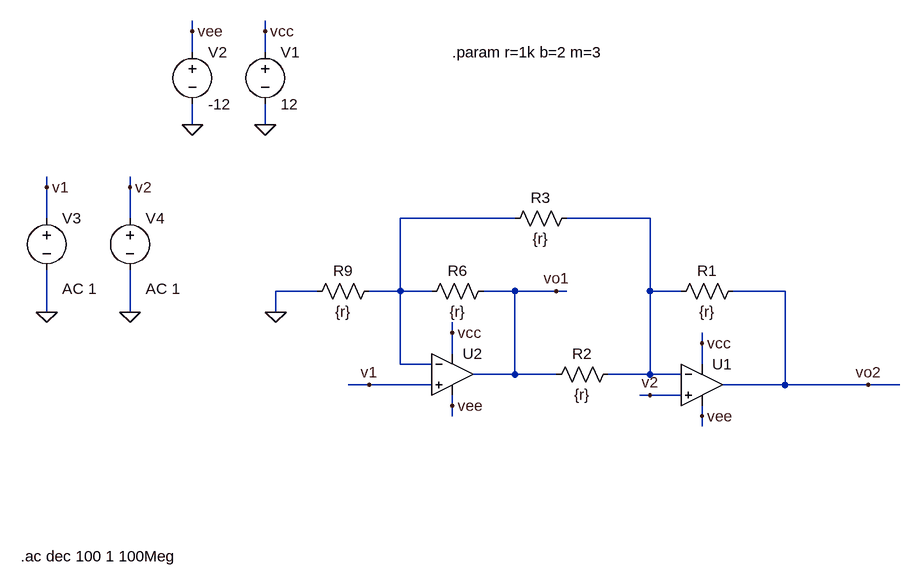
[diagram p0: schematic Draft1.asc]
Draft1.asc, the LTspice schematic file:
Version 4
SHEET 1 1172 680
WIRE -400 -176 -400 -192
WIRE -288 -176 -288 -192
WIRE -400 -144 -400 -176
WIRE -288 -144 -288 -176
WIRE -400 -32 -400 -64
WIRE -288 -32 -288 -64
WIRE -624 64 -624 48
WIRE -496 64 -496 48
WIRE -624 112 -624 64
WIRE -496 112 -496 64
WIRE 96 112 -80 112
WIRE 304 112 176 112
WIRE -208 224 -272 224
WIRE -80 224 -80 112
WIRE -80 224 -128 224
WIRE -32 224 -80 224
WIRE 96 224 48 224
WIRE 160 224 96 224
WIRE 176 224 160 224
WIRE 304 224 304 112
WIRE 352 224 304 224
WIRE 512 224 432 224
WIRE -624 256 -624 192
WIRE -496 256 -496 192
WIRE -272 256 -272 224
WIRE 0 288 0 272
WIRE 384 304 384 288
WIRE 0 320 0 288
WIRE -80 336 -80 224
WIRE -32 336 -80 336
WIRE 384 336 384 304
WIRE 96 352 96 224
WIRE 96 352 32 352
WIRE 160 352 96 352
WIRE 304 352 304 224
WIRE 304 352 240 352
WIRE 352 352 304 352
WIRE -128 368 -160 368
WIRE -32 368 -128 368
WIRE 512 368 512 224
WIRE 512 368 416 368
WIRE 640 368 512 368
WIRE 688 368 640 368
WIRE 304 384 288 384
WIRE 352 384 304 384
WIRE 0 400 0 384
WIRE 0 416 0 400
WIRE 384 416 384 400
WIRE 384 432 384 416
FLAG -288 -32 0
FLAG -400 -32 0
FLAG -288 -176 vcc
FLAG -400 -176 vee
FLAG -624 256 0
FLAG -624 64 v1
FLAG -496 256 0
FLAG -496 64 v2
FLAG 0 288 vcc
FLAG 0 400 vee
FLAG -272 256 0
FLAG 384 304 vcc
FLAG 384 416 vee
FLAG -128 368 v1
FLAG 304 384 v2
FLAG 160 224 vo1
FLAG 640 368 vo2
SYMBOL voltage -288 -160 R0
WINDOW 123 0 0 Left 0
WINDOW 39 0 0 Left 0
SYMATTR InstName V1
SYMATTR Value 12
SYMBOL voltage -400 -160 R0
WINDOW 123 0 0 Left 0
WINDOW 39 0 0 Left 0
SYMATTR InstName V2
SYMATTR Value -12
SYMBOL voltage -624 96 R0
WINDOW 123 24 124 Left 2
WINDOW 39 0 0 Left 0
SYMATTR Value2 AC 1
SYMATTR InstName V3
SYMATTR Value ""
SYMBOL voltage -496 96 R0
WINDOW 123 24 124 Left 2
WINDOW 39 0 0 Left 0
SYMATTR Value2 AC 1
SYMATTR InstName V4
SYMATTR Value ""
SYMBOL OpAmps\\UniversalOpamp2 0 352 R0
SYMATTR InstName U2
SYMBOL res 64 208 R90
WINDOW 0 0 56 VBottom 2
WINDOW 3 32 56 VTop 2
SYMATTR InstName R6
SYMATTR Value {r}
SYMBOL res -112 208 R90
WINDOW 0 0 56 VBottom 2
WINDOW 3 32 56 VTop 2
SYMATTR InstName R9
SYMATTR Value {r}
SYMBOL OpAmps\\UniversalOpamp2 384 368 R0
SYMATTR InstName U1
SYMBOL res 448 208 R90
WINDOW 0 0 56 VBottom 2
WINDOW 3 32 56 VTop 2
SYMATTR InstName R1
SYMATTR Value {r}
SYMBOL res 256 336 R90
WINDOW 0 0 56 VBottom 2
WINDOW 3 32 56 VTop 2
SYMATTR InstName R2
SYMATTR Value {r}
SYMBOL res 192 96 R90
WINDOW 0 0 56 VBottom 2
WINDOW 3 32 56 VTop 2
SYMATTR InstName R3
SYMATTR Value {r}
TEXT 0 -144 Left 2 !.param r=1k b=2 m=3
TEXT -664 632 Left 2 !.ac dec 100 1 100Meg

The netlist it stands for:
* Draft1.asc
V1 vcc 0 12
V2 vee 0 -12
V3 v1 0 AC 1
V4 v2 0 AC 1
XU2 v1 N001 vcc vee vo1 level.2 Avol=1Meg GBW=10Meg Slew=10Meg ilimit=25m rail=0 Vos=0 phimargin=45 en=0 enk=0 in=0 ink=0 Rin=500Meg  ; pins IN+ IN- V+ V- OUT
R6 vo1 N001 {r}
R9 N001 0 {r}
XU1 v2 N002 vcc vee vo2 level.2 Avol=1Meg GBW=10Meg Slew=10Meg ilimit=25m rail=0 Vos=0 phimargin=45 en=0 enk=0 in=0 ink=0 Rin=500Meg  ; pins IN+ IN- V+ V- OUT
R1 vo2 N002 {r}
R2 N002 vo1 {r}
R3 N002 N001 {r}
.param r=1k b=2 m=3
.ac dec 100 1 100Meg
.lib UniversalOpamps2.sub
.backanno
.end